# Altium schematic sheet Touch.SchDoc
size A4
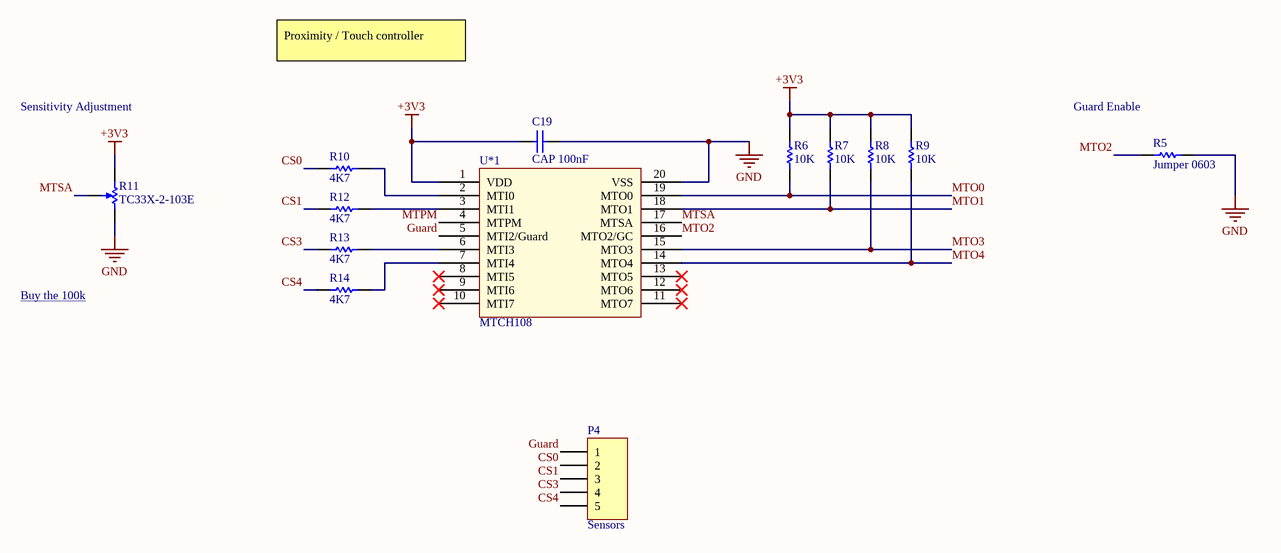
[diagram p0: Touch.SchDoc]

## Parts
C19  CAP 100nF  [CAPC0603(1608)100_M]
P4  Sensors  [HDR1X5]
R5  Jumper 0603  [RESC0603(1608)_N]
R6  10K  [RESC0603(1608)_N]
R7  10K  [RESC0603(1608)_N]
R8  10K  [RESC0603(1608)_N]
R9  10K  [RESC0603(1608)_N]
R10  4K7  [RESC0603(1608)_N]
R11  TC33X-2-103E  [BOUR-TC33X-2_V]
R12  4K7  [RESC0603(1608)_N]
R13  4K7  [RESC0603(1608)_N]
R14  4K7  [RESC0603(1608)_N]
U*1  MTCH108  [MTCH-108 SSOP]

## Nets
+3V3: C19.2 R6.2 R7.2 R8.2 R9.2 R11.1 U*1.1(VDD)
GND: C19.1 R5.2 R11.3 U*1.20(VSS)
CS0: P4.2 R10.1
CS1: P4.3 R12.1
CS3: P4.4 R13.1
CS4: P4.5 R14.1
Guard: P4.1 U*1.5(MTI2/Guard)
MTO0: R6.1 U*1.19(MTO0)
MTO1: R7.1 U*1.18(MTO1)
MTO2: R5.1 U*1.16(MTO2/GC)
MTO3: R8.1 U*1.15(MTO3)
MTO4: R9.1 U*1.14(MTO4)
MTPM: U*1.4(MTPM)
MTSA: R11.2 U*1.17(MTSA)
NetR10_2: R10.2 U*1.2(MTI0)
NetR12_2: R12.2 U*1.3(MTI1)
NetR13_2: R13.2 U*1.6(MTI3)
NetR14_2: R14.2 U*1.7(MTI4)

Not connected (* = marked no-connect by the designer): U*1 8(MTI5)* 9(MTI6)* 10(MTI7)* 11(MTO7)* 12(MTO6)* 13(MTO5)*

## Notes on the sheet
- Proximity / Touch controller
- Sensitivity Adjustment
- (near R5) Guard Enable
- Buy the 100k <https://www.digikey.com.au/product-detail/en/bourns-inc/TC33X-2-104E/TC33X-104ETR-ND/612859>

## Library data of the parts
C19 = CMP-1035-02583-1: CAP 100nF 16V ±5% 0603 (1608 Metric) Thickness 1mm SMD; Tolerance: Â±5%; Case-Metric: 1608; Case-EIA: 0603; Rated Voltage: 16 V; Max Thickness: 1 mm; Technology: SMT; Value: 100nF
P4 = Header 5: Header, 5-Pin; LatestRevisionDate: 17-Jul-2002; LatestRevisionNote: Re-released for DXP Platform.; Publisher: Altium Limited
R5 = CMP-1012-00001-1: Jumper 0603 (1608 Metric); Case-Metric: 1608; Value: 0.00 Ohm; Power: None; Case-EIA: 0603; Technology: SMT; Tolerance: None
R6-R9 = CMP-1012-00098-1: 10K 0.1W 5% 0603 (1608 Metric)  SMD; Case-EIA: 0603; Value: 10000.00 Ohm; Case-Metric: 1608; Technology: SMT; Tolerance: 5 %; Power: 0.1 W
R10 R12-R14 = CMP-1012-00090-1: 4K7 0.1W 5% 0603 (1608 Metric)  SMD; Case-Metric: 1608; Value: 4700.00 Ohm; Case-EIA: 0603; Tolerance: 5 %; Technology: SMT; Power: 0.1 W
R11 = CMP-2100-03695-1: Trimming Potentiometer, 10000 Ohm, -40 to 100 degC, 3-Pin SMD, RoHS, Tape and Reel; Manufacturer: Bourns; Tolerance: 25%; Max Power Dissipation: 100mW; Number of Turns: 1; Resistance: 10KOhm; Temperature Coefficient: 250ppm/degreesC; Voltage Rating (DC): 50V; Datasheet URL: http://www.bourns.com/docs/Product-Datasheets/TC33.pdf; Composition: Potentiometer; Package Description: 3-Pin Surface Mount Device, Body 3.8 x 3.6 mm; Weight: 29.4mg; Power Rating: 100mW; Termination: FootPrint; Manufacturer URL: http://www.bourns.com/; Width: 0.118inch; Height: 0.047inch; Military Standard: Not; Radiation Hardening: No; Colour: Silver; Case/Package: SMD/SMT; Depth: 3.8mm; Min Operating Temperature: -40degC; Lead Free: LeadFree; Datasheet Version: 42583.0; REACH SVHC: NoSVHC; Length: 3mm; RoHSCompliant: true; Contact Plating: Silver; Taper: Linear; Packaging: TapeandReel; Mount: SurfaceMount; Max Operating Temperature: 100degC; Package Reference: TC33X-2; Package Quantity: 2500
U*1 = MTCH108: ComponentLink1Description: Datasheet; ComponentLink1URL: http://ww1.microchip.com/downloads/en/DeviceDoc/40001793C.pdf